# Altium schematic sheet BC95.SchDoc
size A4
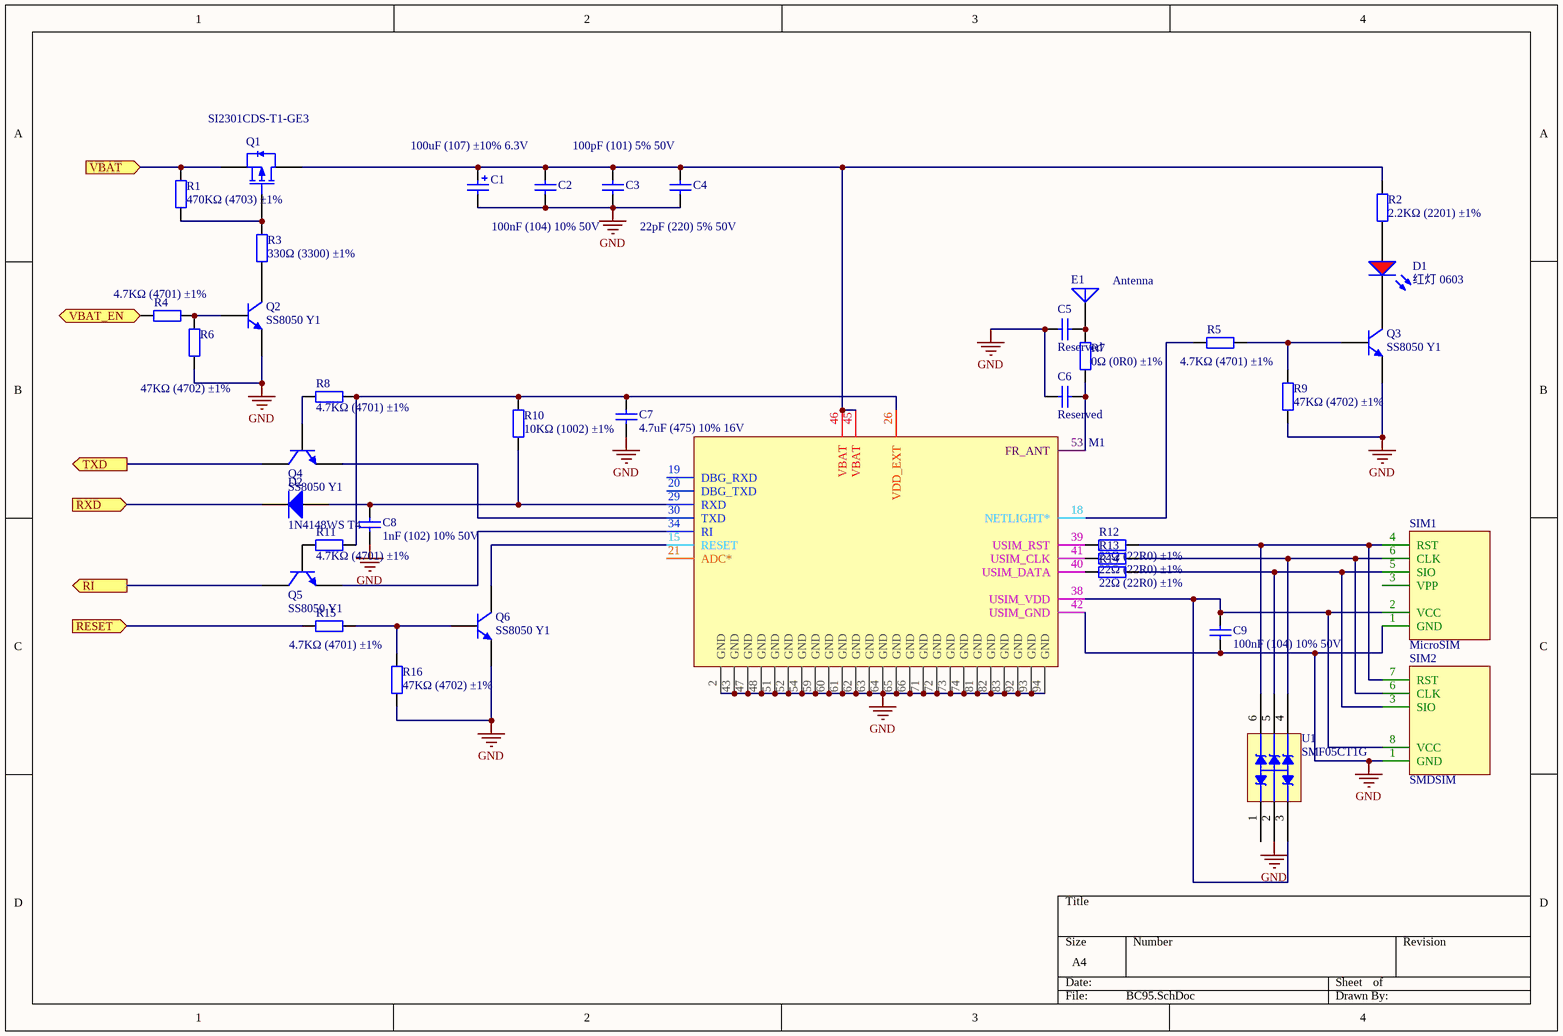
[diagram p0: BC95.SchDoc]

## Parts
C1  100uF (107) ±10% 6.3V  [CASE-B_3528]
C2  100nF (104) 10% 50V  [0603_C]
C3  100pF (101) 5% 50V  [0603_C]
C4  22pF (220) 5% 50V  [0603_C]
C5  Reserved  [0603_C]
C6  Reserved  [0603_C]
C7  4.7uF (475) 10% 16V  [0603_C]
C8  1nF (102) 10% 50V  [0603_C]
C9  100nF (104) 10% 50V  [0603_C]
D1  红灯 0603  [0603_LED_S1]
D2  1N4148WS T4  [SOD-323]
E1  Antenna  [PIN1]
M1  BC95-B5  [BC95-B]  (value not drawn)
Q1  SI2301CDS-T1-GE3  [SOT-23(SOT-23-3)]
Q2  SS8050 Y1  [SOT-23(SOT-23-3)]
Q3  SS8050 Y1  [SOT-23(SOT-23-3)]
Q4  SS8050 Y1  [SOT-23(SOT-23-3)]
Q5  SS8050 Y1  [SOT-23(SOT-23-3)]
Q6  SS8050 Y1  [SOT-23(SOT-23-3)]
R1  470KΩ (4703) ±1%  [0603_R]
R2  2.2KΩ (2201) ±1%  [0603_R]
R3  330Ω (3300) ±1%  [0603_R]
R4  4.7KΩ (4701) ±1%  [0603_R]
R5  4.7KΩ (4701) ±1%  [0603_R]
R6  47KΩ (4702) ±1%  [0603_R]
R7  0Ω (0R0) ±1%  [0603_R]
R8  4.7KΩ (4701) ±1%  [0603_R]
R9  47KΩ (4702) ±1%  [0603_R]
R10  10KΩ (1002) ±1%  [0603_R]
R11  4.7KΩ (4701) ±1%  [0603_R]
R12  22Ω (22R0) ±1%  [0603_R]
R13  22Ω (22R0) ±1%  [0603_R]
R14  22Ω (22R0) ±1%  [0603_R]
R15  4.7KΩ (4701) ±1%  [0603_R]
R16  47KΩ (4702) ±1%  [0603_R]
SIM1  MicroSIM  [SIM-01A]
SIM2  SMDSIM  [VQFN48]
U1  SMF05CT1G  [SC-70-6(SOT-363)]

## Ports
RESET (in), RI (out), RXD (in), TXD (out), VBAT (in), VBAT_EN (in)

## Nets
GND: C1.2 C2.2 C3.1 C4.1 C5.1 C6.1 C7.1 C8.1 C9.1 M1.2(GND) M1.42(USIM_GND) M1.43(GND) M1.47(GND) M1.48(GND) M1.51(GND) M1.52(GND) M1.54(GND) M1.59(GND) M1.60(GND) M1.61(GND) M1.62(GND) M1.63(GND) M1.64(GND) M1.65(GND) M1.66(GND) M1.71(GND) M1.72(GND) M1.73(GND) M1.74(GND) M1.81(GND) M1.82(GND) M1.83(GND) M1.92(GND) M1.93(GND) M1.94(GND) Q2.2(E) Q3.2(E) Q6.2(E) R6.1 R9.1 R16.1 SIM1.1(GND) SIM2.1(GND) U1.2
RESET: R15.1 ; port RESET
RI: Q5.3(C) ; port RI
RXD: D2.2(K) ; port RXD
TXD: Q4.3(C) ; port TXD
VBAT: Q1.2(S) R1.1 ; port VBAT
VBAT_EN: R4.1 ; port VBAT_EN
NetC1_1: C1.1 C2.1 C3.2 C4.2 M1.45(VBAT) M1.46(VBAT) Q1.3(D) R2.2
NetC5_2: C5.2 E1.1(A) R7.2
NetC6_2: C6.2 M1.53(FR_ANT) R7.1
NetC7_2: C7.2 M1.26(VDD_EXT) R8.1 R10.1 R11.2
NetC8_2: C8.2 D2.1(A) M1.29(RXD) R10.2
NetC9_2: C9.2 M1.38(USIM_VDD) SIM1.2(VCC) SIM2.8(VCC) U1.3
NetD1_A: D1.A R2.1
NetD1_K: D1.K Q3.3(C)
NetM1_15: M1.15(RESET) Q6.3(C)
NetM1_18: M1.18(NETLIGHT*) R5.1
NetM1_30: M1.30(TXD) Q4.2(E)
NetM1_34: M1.34(RI) Q5.2(E)
NetM1_39: M1.39(USIM_RST) R12.1
NetM1_40: M1.40(USIM_DATA) R14.1
NetM1_41: M1.41(USIM_CLK) R13.1
NetQ1_1: Q1.1(G) R1.2 R3.2
NetQ2_1: Q2.1(B) R4.2 R6.2
NetQ2_3: Q2.3(C) R3.1
NetQ3_1: Q3.1(B) R5.2 R9.2
NetQ4_1: Q4.1(B) R8.2
NetQ5_1: Q5.1(B) R11.1
NetQ6_1: Q6.1(B) R15.2 R16.2
NetR12_2: R12.2 SIM1.4(RST) SIM2.7(RST) U1.6
NetR13_2: R13.2 SIM1.6(CLK) SIM2.6(CLK) U1.4
NetR14_2: R14.2 SIM1.5(SIO) SIM2.3(SIO) U1.5

Not connected (* = marked no-connect by the designer): M1 1(RESERVED) 3(RESERVED) 4(RESERVED) 5(RESERVED) 6(RESERVED) 7(RESERVED) 8(RESERVED) 9(RESERVED) 10(RESERVED) 11(RESERVED) 12(RESERVED) 13(RESERVED) 14(RESERVED) 16(RESERVED) 17(RESERVED) 19(DBG_RXD) 20(DBG_TXD) 21(ADC*) 22(RESERVED) 23(RESERVED) 24(RESERVED) 25(RESERVED) 27(RESERVED) 28(RESERVED) 31(RESERVED) 32(RESERVED) 33(RESERVED) 35(RESERVED) 36(RESERVED) 37(RESERVED) 44(RESERVED) 49(RESERVED) 50(RESERVED) 55(RESERVED) 56(RESERVED) 57(RESERVED) 58(RESERVED) 67(RESERVED) 68(RESERVED) 69(RESERVED) 70(RESERVED) 75(RESERVED) 76(RESERVED) 77(RESERVED) 78(RESERVED) 79(RESERVED) 80(RESERVED) 84(RESERVED) 85(RESERVED) 86(RESERVED) 87(RESERVED) 88(RESERVED) 89(RESERVED) 90(RESERVED) 91(RESERVED); SIM1 3(VPP); SIM2 2(NC) 4(NC) 5(NC); U1 1

## Library data of the parts
C1 = 3528 100uF (107) 10% 6.3V: 钽电容; ComponentLink1Description: 供应商链接; ComponentLink1URL: http://www.szlcsc.com/product/details_16815.html; Package: 3528; Supplier: LC; SuppliersPartNumber: C16133
C2 C9 = 0603 100nF (104) 10% 50V: 贴片电容; ComponentLink1Description: 供应商链接; ComponentLink1URL: http://www.szlcsc.com/product/details_15331.html; Package: 0603; Supplier: LC; SuppliersPartNumber: C14663
C3 = 0603 100pF (101) 5% 50V: 贴片电容; ComponentLink1Description: 供应商链接; ComponentLink1URL: http://www.szlcsc.com/product/details_15530.html; Package: 0603; Supplier: LC; SuppliersPartNumber: C14858
C4-C6 = 0603 22pF (220) 5% 50V: 贴片电容; ComponentLink1Description: 供应商链接; ComponentLink1URL: http://www.szlcsc.com/product/details_2005.html; Package: 0603; Supplier: LC; SuppliersPartNumber: C1653
C7 = 0603 4.7uF (475) 10% 16V: 贴片电容; ComponentLink1Description: 供应商链接; ComponentLink1URL: http://www.szlcsc.com/product/details_20375.html; Package: 0603; Supplier: LC; SuppliersPartNumber: C19666
C8 = 0603 1nF (102) 10% 50V: 贴片电容; ComponentLink1Description: 供应商链接; ComponentLink1URL: http://www.szlcsc.com/product/details_1940.html; Package: 0603; Supplier: LC; SuppliersPartNumber: C1588
D1 = 0603 红灯: 发光二极管; ComponentLink1Description: 供应商链接; ComponentLink1URL: http://www.szlcsc.com/product/details_2659.html; Package: 0603; Supplier: LC; SuppliersPartNumber: C2286
D2 = SOD-323 1N4148WS T4: 二极管; ComponentLink1Description: 供应商链接; ComponentLink1URL: http://www.szlcsc.com/product/details_2485.html; Package: SOD-323; Supplier: LC; SuppliersPartNumber: C2128
E1 = Antenna: Generic Antenna; Published: 24-Mar-1999; LatestRevisionDate: 17-Jul-2002; LatestRevisionNote: Re-released for DXP Platform.; PackageReference: PIN1; Publisher: Altium Limited
M1 = BC95-B5: NB-IOT模块 电信
Q1 = SI2301CDS-T1-GE3: MOS(场效应管); ComponentLink1Description: 供应商链接; ComponentLink1URL: http://www.szlcsc.com/product/details_11030.html; Package: SOT-23(SOT-23-3); Supplier: LC; SuppliersPartNumber: C10487
Q2-Q6 = SOT-23 SS8050 Y1: 三极管; ComponentLink1Description: 供应商链接; ComponentLink1URL: http://www.szlcsc.com/product/details_2507.html; Package: SOT-23; Supplier: LC; SuppliersPartNumber: C2150
R1 = 0603 470KΩ (4703) 1%: 贴片电阻; ComponentLink1Description: 供应商链接; ComponentLink1URL: http://www.szlcsc.com/product/details_23905.html; Package: 0603; Supplier: LC; SuppliersPartNumber: C23178
R2 = 0603 2.2KΩ (2201) 1%: 贴片电阻; ComponentLink1Description: 供应商链接; ComponentLink1URL: http://www.szlcsc.com/product/details_4597.html; Package: 0603; Supplier: LC; SuppliersPartNumber: C4190
R3 = 0603 330Ω (3300) 1%: 贴片电阻; ComponentLink1Description: 供应商链接; ComponentLink1URL: http://www.szlcsc.com/product/details_23865.html; Package: 0603; Supplier: LC; SuppliersPartNumber: C23138
R4 R5 R8 R11 R15 = 0603 4.7KΩ (4701) 1%: 贴片电阻; ComponentLink1Description: 供应商链接; ComponentLink1URL: http://www.szlcsc.com/product/details_23889.html; Package: 0603; Supplier: LC; SuppliersPartNumber: C23162
R6 R9 R16 = 0603 47KΩ (4702) 1%: 贴片电阻; ComponentLink1Description: 供应商链接; ComponentLink1URL: http://www.szlcsc.com/product/details_26562.html; Package: 0603; Supplier: LC; SuppliersPartNumber: C25819
R7 = 0603 0Ω (0R0) 1%: 贴片电阻; ComponentLink1Description: 供应商链接; ComponentLink1URL: http://www.szlcsc.com/product/details_21903.html; Package: 0603; Supplier: LC; SuppliersPartNumber: C21189
R10 = 0603 10KΩ (1002) 1%: 贴片电阻; ComponentLink1Description: 供应商链接; ComponentLink1URL: http://www.szlcsc.com/product/details_26547.html; Package: 0603; Supplier: LC; SuppliersPartNumber: C25804
R12-R14 = 0603 22Ω (22R0) 1%: 贴片电阻; ComponentLink1Description: 供应商链接; ComponentLink1URL: http://www.szlcsc.com/product/details_24078.html; Package: 0603; Supplier: LC; SuppliersPartNumber: C23345
SIM1 = MicroSIM: MicroSIM卡座
SIM2 = SMDSIM: SMDSIM芯片
U1 = SMF05CT1G: TVS; ComponentLink1Description: 供应商链接; ComponentLink1URL: http://www.szlcsc.com/product/details_16561.html; Package: SC-70-6(SOT-363); Supplier: LC; SuppliersPartNumber: C15879